# Altium schematic sheet Archive.SchDoc
size A4; SheetNumber: 4; SheetTotal: 4
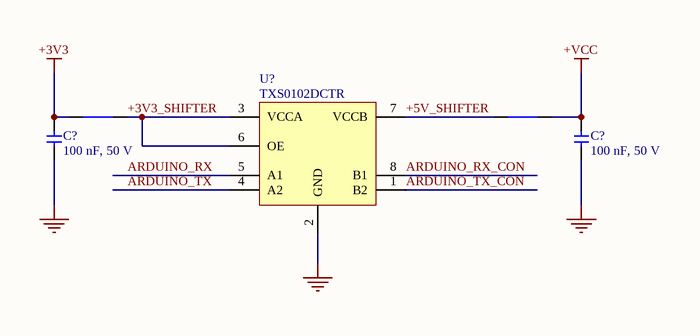
[diagram p0: Archive.SchDoc]

## Parts
(Parts that share a designator on the sheet are numbered #1, #2 ... from top to bottom, then left to right.)
C?#1  100 nF, 50 V  [1206_CAP]
C?#2  100 nF, 50 V  [1206_CAP]
NT?#1  NT  [NetTie_SMD]  (value not drawn)  (net tie, no BOM)
NT?#2  NT  [NetTie_SMD]  (value not drawn)  (net tie, no BOM)
U?  TXS0102DCTR  [SOP65P400X130-8N]

## Nets
+3V3: C?#1.2 NT?#1.1
+VCC: C?#2.2 NT?#2.2
GND: C?#1.1 C?#2.1 U?.2(GND)
+3V3_SHIFTER: NT?#1.2 U?.3(VCCA) U?.6(OE)
+5V_SHIFTER: NT?#2.1 U?.7(VCCB)
ARDUINO_RX: U?.5(A1)
ARDUINO_RX_CON: U?.8(B1)
ARDUINO_TX: U?.4(A2)
ARDUINO_TX_CON: U?.1(B2)

## Library data of the parts
C?#1 C?#2 = 1206B104K500CT: Ceramic Capacitor, Multilayer, Ceramic, 50V, 10% +Tol, 10% -Tol, X7R, 15% TC, 0.1uF, Surface Mount, 1206; Manufacturer: Walsin Technologies; Value: 100nF; Multilayer: Yes; Supplier: Digikey; Supplier Part Number: 1292-1605-1-ND; Manufacturer Part Number: 1206B104K500CT; RoHS: Yes; Category: Ceramic Capacitors; Stock: 1578618; Pricing: 1=0.11, 10=0.061, 100=0.0383, 1000=0.02628 (USD); Mounting Technology: Surface Mount; Pins: 2; Dielectric Material: Ceramic; Package Shape: Rectangular; Case/Package: 1206; Terminal Finish: Nickel; Min Operating Temperature: -55°C; Max Operating Temperature: 125°C; JESD-609 Code: e3; Capacitor Type: Ceramic; Tolerance  (fill in as +-): 10%; Package Style: SMTMeter; Packaging: Tape and Reel; Tolerance (fill in as +-): 10%; Rated DC Voltage (URdc): 50V; Temperature Characteristics Code: X7R; Termination: Wraparound; Length: 3.2mm; Width: 1.6mm; Height: 0.8mm; Reach SVHC Compliant: Yes; RoHS Compliant: Yes; ComponentLink1URL: https://datasheet.ciiva.com:443/pdfs/VipMasterIC/IC/WATC/WATC-S-A0009550342/WATC-S-A0009550342-1.pdf?src-supplier=IHS+Markit; ComponentLink1Description: https://datasheet.ciiva.com:443/pdfs/VipMasterIC/IC/WATC/WATC-S-A0009550342/WATC-S-A0009550342-1.pdf?src-supplier=IHS+Markit; ComponentLink2URL: http://www.farnell.com/datasheets/2340522.pdf?src-supplier=Farnell; ComponentLink2Description: http://www.farnell.com/datasheets/2340522.pdf?src-supplier=Farnell; ComponentLink3URL: http://www.farnell.com/datasheets/2340522.pdf?src-supplier=Newark; ComponentLink3Description: http://www.farnell.com/datasheets/2340522.pdf?src-supplier=Newark; ComponentLink4URL: http://www.passivecomponent.com/wp-content/uploads/2018/10/MLCC.pdf?src-supplier=Digikey; ComponentLink4Description: http://www.passivecomponent.com/wp-content/uploads/2018/10/MLCC.pdf?src-supplier=Digikey; ComponentLink5URL: https://datasheet.octopart.com/1206B104K500CT-Walsin-Technologies-datasheet-85392065.pdf?src-supplier=Element14; ComponentLink5Description: https://datasheet.octopart.com/1206B104K500CT-Walsin-Technologies-datasheet-85392065.pdf?src-supplier=Element14; ComponentLink6URL: http://www.farnell.com/datasheets/1958513.pdf?src-supplier=Element14; ComponentLink6Description: http://www.farnell.com/datasheets/1958513.pdf?src-supplier=Element14; ComponentLink7URL: http://www.farnell.com/datasheets/2340522.pdf?src-supplier=Element14; ComponentLink7Description: http://www.farnell.com/datasheets/2340522.pdf?src-supplier=Element14; ComponentLink8URL: https://www.verical.com/server-webapp/html/getDatasheet?partID=71573&src-supplier=Verical; ComponentLink8Description: https://www.verical.com/server-webapp/html/getDatasheet?partID=71573&src-supplier=Verical; ComponentLink9URL: https://datasheet.octopart.com/1206B104K500CT-Walsin-Technologies-datasheet-128065749.pdf?src-supplier=Future+Electronics; ComponentLink9Description: https://datasheet.octopart.com/1206B104K500CT-Walsin-Technologies-datasheet-128065749.pdf?src-supplier=Future+Electronics; ComponentLink10URL: https://datasheet.octopart.com/1206B104K500CT-Walsin-Technologies-datasheet-62066062.pdf?src-supplier=TME; ComponentLink10Description: https://datasheet.octopart.com/1206B104K500CT-Walsin-Technologies-datasheet-62066062.pdf?src-supplier=TME
NT?#1 NT?#2 = NetTie_SMD: Net TIE SMD
U? = TXS0102DCTR: Voltage Level Translator Bidirectional 1 Circuit 2 Channel 24Mbps SM8; Manufacturer: Texas Instruments; Package Body Material: Plastic; Interface IC Type: INTERFACE CIRCUIT; Channels: 1; Power Supplies: 1.8/3.3,2.5/5V; Supply Voltage1-Max: 5.5V; Supply Voltage1-Min: 2.3V; Supply Voltage1-Nom: 2.5V; Max Supply Voltage: 3.6V; Min Supply Voltage: 1.65V; Nominal Supply Voltage: 1.8V; Qualification Status: Not Qualified; Supplier: Digikey; Supplier Part Number: 296-TXS0102DCTRCT-ND; Manufacturer Part Number: TXS0102DCTR; RoHS: Yes; Category: Integrated Circuits (ICs); Stock: 18372; Pricing: 1=0.49, 10=0.343, 25=0.306, 100=0.2658, 250=0.2466, 500=0.23504, 1000=0.2255 (USD); Case/Package: LSSOP; Pins: 8; Package Shape: Rectangular; Terminal Finish: Nickel; Min Operating Temperature: -40°C; Max Operating Temperature: 85°C; JESD-609 Code: e4; JESD-30 Code: R-PDSO-G8; Moisture Sensitivity Level: 1; Package Style: SMALL OUTLINE, LOW PROFILE, SHRINK PITCHMeter; Peak Reflow Temperature (Cel): 260°C; Surface Mount: Yes; Terminal Form: Gull Wing; Terminal Position: DUAL; Length: 2.95mm; Width: 2.8mm; Height - Seated (Max): 1.3mm; Terminal Pitch: 0.65mm; Temperature Grade: INDUSTRIAL; Reach SVHC Compliant: Yes; RoHS Compliant: Yes; ComponentLink1URL: https://www.ti.com:443/lit/ds/symlink/txs0102.pdf?src-supplier=IHS+Markit; ComponentLink1Description: https://www.ti.com:443/lit/ds/symlink/txs0102.pdf?src-supplier=IHS+Markit; ComponentLink2URL: https://datasheet.ciiva.com/4834/sces640d-204615-4834322.pdf?src-supplier=Mouser; ComponentLink2Description: https://datasheet.ciiva.com/4834/sces640d-204615-4834322.pdf?src-supplier=Mouser; ComponentLink3URL: https://datasheet.ciiva.com/15096/getdatasheetpartid-172987-15096217.pdf?src-supplier=Verical; ComponentLink3Description: https://datasheet.ciiva.com/15096/getdatasheetpartid-172987-15096217.pdf?src-supplier=Verical; ComponentLink4URL: https://datasheet.ciiva.com/14287/txs0102-14287909.pdf?src-supplier=Avnet; ComponentLink4Description: https://datasheet.ciiva.com/14287/txs0102-14287909.pdf?src-supplier=Avnet; ComponentLink5URL: https://datasheet.ciiva.com/1899/txs0102-1899626.pdf?src-supplier=Digikey; ComponentLink5Description: https://datasheet.ciiva.com/1899/txs0102-1899626.pdf?src-supplier=Digikey; ComponentLink6URL: https://datasheet.ciiva.com/1899/txs0102-1899627.pdf?src-supplier=Digikey; ComponentLink6Description: https://datasheet.ciiva.com/1899/txs0102-1899627.pdf?src-supplier=Digikey; ComponentLink7URL: https://datasheet.ciiva.com/1899/txs0102-1899628.pdf?src-supplier=Digikey; ComponentLink7Description: https://datasheet.ciiva.com/1899/txs0102-1899628.pdf?src-supplier=Digikey; ComponentLink8URL: https://datasheet.ciiva.com/22714/1863639-22714744.pdf?src-supplier=Element14; ComponentLink8Description: https://datasheet.ciiva.com/22714/1863639-22714744.pdf?src-supplier=Element14; ComponentLink9URL: https://datasheet.ciiva.com/28594/1863639-28594840.pdf?src-supplier=Element14; ComponentLink9Description: https://datasheet.ciiva.com/28594/1863639-28594840.pdf?src-supplier=Element14